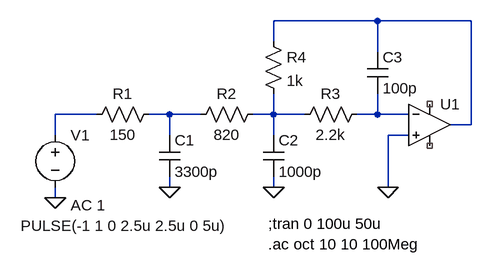
[diagram p0: schematic 3rd MFB with POT.asc]
3rd MFB with POT.asc, the LTspice schematic file:
Version 4
SHEET 1 880 680
WIRE 688 0 528 0
WIRE 832 0 688 0
WIRE 528 32 528 0
WIRE 688 48 688 0
WIRE 256 144 192 144
WIRE 368 144 336 144
WIRE 416 144 368 144
WIRE 528 144 528 112
WIRE 528 144 496 144
WIRE 576 144 528 144
WIRE 688 144 688 112
WIRE 688 144 656 144
WIRE 736 144 688 144
WIRE 832 160 832 0
WIRE 832 160 800 160
WIRE 192 176 192 144
WIRE 368 176 368 144
WIRE 528 176 528 144
WIRE 736 176 704 176
WIRE 368 256 368 240
WIRE 528 256 528 240
WIRE 704 256 704 176
WIRE 192 272 192 256
FLAG 192 272 0
FLAG 528 256 0
FLAG 704 256 0
FLAG 368 256 0
SYMBOL voltage 192 160 R0
WINDOW 3 -53 155 Left 2
WINDOW 123 24 124 Left 2
WINDOW 39 0 0 Left 2
SYMATTR InstName V1
SYMATTR Value PULSE(-1 1 0 2.5u 2.5u 0 5u)
SYMATTR Value2 AC 1
SYMBOL res 512 128 R90
WINDOW 0 0 56 VBottom 2
WINDOW 3 32 56 VTop 2
SYMATTR InstName R2
SYMATTR Value 820
SYMBOL res 672 128 R90
WINDOW 0 0 56 VBottom 2
WINDOW 3 32 56 VTop 2
SYMATTR InstName R3
SYMATTR Value 2.2k
SYMBOL cap 512 176 R0
SYMATTR InstName C2
SYMATTR Value 1000p
SYMBOL res 512 16 R0
SYMATTR InstName R4
SYMATTR Value 1k
SYMBOL cap 672 48 R0
SYMATTR InstName C3
SYMATTR Value 100p
SYMBOL Opamps\\UniversalOpamp2 768 160 R0
SYMATTR InstName U1
SYMBOL cap 352 176 R0
SYMATTR InstName C1
SYMATTR Value 3300p
SYMBOL res 352 128 R90
WINDOW 0 0 56 VBottom 2
WINDOW 3 32 56 VTop 2
SYMATTR InstName R1
SYMATTR Value 150
TEXT 520 344 Left 2 !.ac oct 10 10 100Meg
TEXT 520 312 Left 2 !;tran 0 100u 50u

The netlist it stands for:
* 3rd MFB with POT.asc
V1 N002 0 PULSE(-1 1 0 2.5u 2.5u 0 5u) AC 1
R2 N004 N003 820
R3 N005 N004 2.2k
C2 N004 0 1000p
R4 N001 N004 1k
C3 N001 N005 100p
XU1 0 N005 NC_01 NC_02 N001 level.2 Avol=1Meg GBW=10Meg Slew=10Meg ilimit=25m rail=0 Vos=0 phimargin=45 en=0 enk=0 in=0 ink=0 Rin=500Meg  ; pins IN+ IN- V+ V- OUT
C1 N003 0 3300p
R1 N003 N002 150
.ac oct 10 10 100Meg
;tran 0 100u 50u
.lib UniversalOpamps2.sub
.backanno
.end